# EAGLE design BigEasyDriver_v12 (EAGLE 5.06)
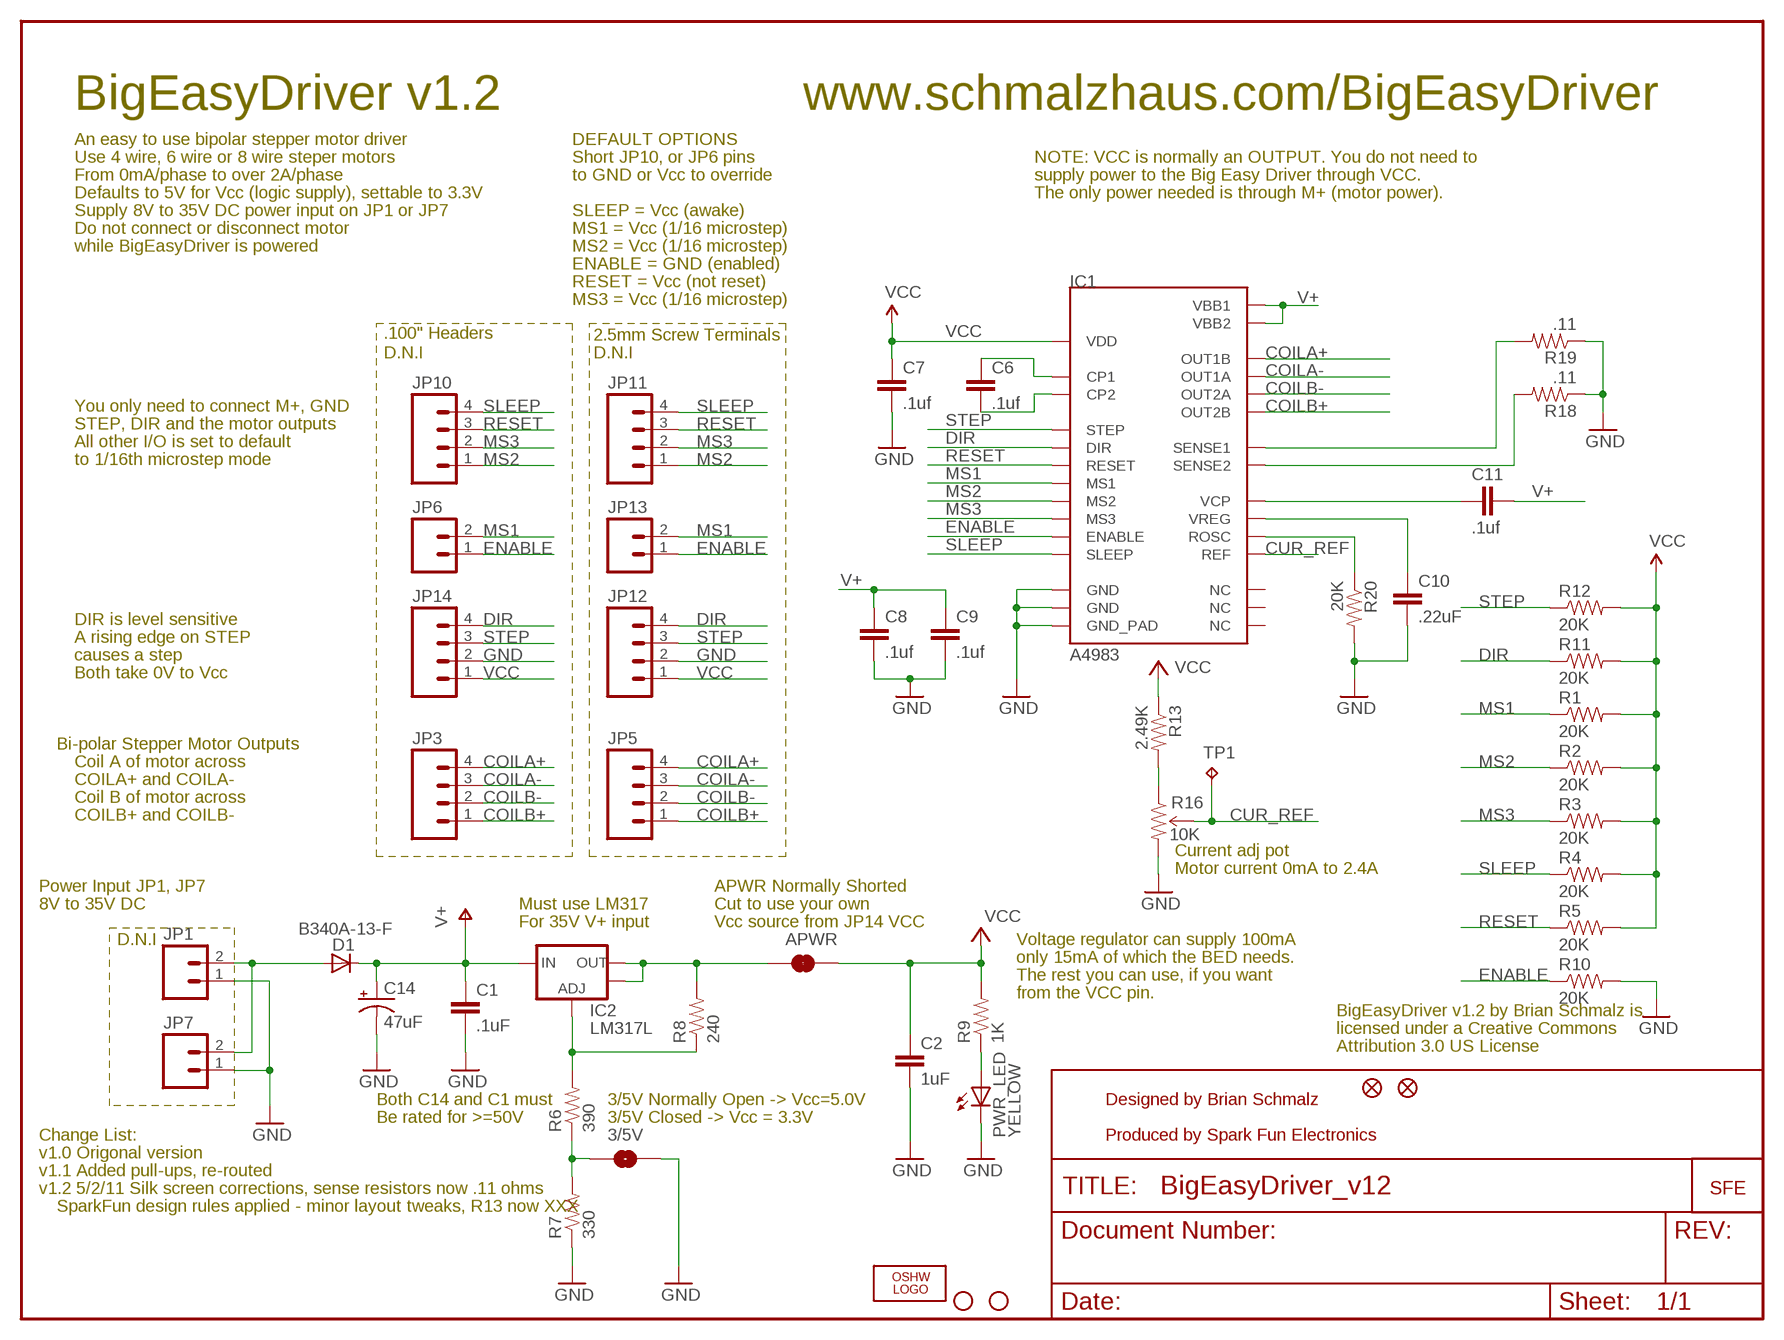
[diagram p0: schematic, sheet 1]

## Parts
3/5V  SOLDERJUMPERNO  [SJ_2S-NO]
APWR  SOLDERJUMPERTRACE  [SJ_2S-TRACE]
C1  .1uF  CAP0402-CAP  [0402-CAP]
C2  1uF  CAP0402-CAP  [0402-CAP]
C6  .1uf  CAP0402-CAP  [0402-CAP]
C7  .1uf  CAP0402-CAP  [0402-CAP]
C8  .1uf  CAP0402-CAP  [0402-CAP]
C9  .1uf  CAP0402-CAP  [0402-CAP]
C10  .22uF  CAP0402-CAP  [0402-CAP]
C11  .1uf  CAP0402-CAP  [0402-CAP]
C14  47uF  CAP_POLD  [PANASONIC_D]
D1  B340A-13-F  DIODE-DO-214AC  [DO-214AC]
IC1  A4983  [QFN-28-5MM]
IC2  LM317L  SPARKFUN03_30_09_V_REG_317SOT89SOT89  [SCHMALZHAUS_SOT89]
JP1  M02PTH  [1X02]
JP2  FIDUCIAL1X2.5  [FIDUCIAL-1X2.5]
JP3  M04PTH  [1X04]
JP4  FIDUCIAL1X2.5  [FIDUCIAL-1X2.5]
JP5  M04SCREW_LOCK  [SCREWTERMINAL-3.5MM-4_LOCK]
JP6  M02PTH  [1X02]
JP7  M023.5MM_LOCK  [SCREWTERMINAL-3.5MM-2_LOCK]
JP8  STAND-OFF  [STAND-OFF]
JP9  STAND-OFF  [STAND-OFF]
JP10  M04PTH  [1X04]
JP11  M04SCREW_LOCK  [SCREWTERMINAL-3.5MM-4_LOCK]
JP12  M04SCREW_LOCK  [SCREWTERMINAL-3.5MM-4_LOCK]
JP13  M023.5MM_LOCK  [SCREWTERMINAL-3.5MM-2_LOCK]
JP14  M04PTH  [1X04]
LOGO1  OSHW_LOGO_FILLX0100-NT  [OSHW_FILLX100_NOTEXT]
PWR_LED  YELLOW  LED0603  [LED-0603]
R1  20K  RESISTOR0402-RES  [0402-RES]
R2  20K  RESISTOR0402-RES  [0402-RES]
R3  20K  RESISTOR0402-RES  [0402-RES]
R4  20K  RESISTOR0402-RES  [0402-RES]
R5  20K  RESISTOR0402-RES  [0402-RES]
R6  390  RESISTOR0402-RES  [0402-RES]
R7  330  RESISTOR0402-RES  [0402-RES]
R8  240  RESISTOR0402-RES  [0402-RES]
R9  1K  RESISTOR0402-RES  [0402-RES]
R10  20K  RESISTOR0402-RES  [0402-RES]
R11  20K  RESISTOR0402-RES  [0402-RES]
R12  20K  RESISTOR0402-RES  [0402-RES]
R13  2.49K  RESISTOR0402-RES  [0402-RES]
R16  10K  TRIMPOTSMD  [TRIMPOT-3MM]
R18  .11  RESISTOR2010  [R2010]
R19  .11  RESISTOR2010  [R2010]
R20  20K  RESISTOR0402-RES  [0402-RES]
TP1  TPPAD1-13  [P1-13]
U$2  LOGO-SFENEW  [SFE-NEW-WEBLOGO]

## Nets
5V_ALT: APWR.1 IC2.OUT IC2.OUT@1(OUT) R8.2
COILA+: IC1.P$21(OUT1B) JP3.4 JP5.4
COILA-: IC1.P$24(OUT1A) JP3.3 JP5.3
COILB+: IC1.P$1(OUT2B) JP3.1 JP5.1
COILB-: IC1.P$26(OUT2A) JP3.2 JP5.2
CUR_REF: IC1.P$17(REF) R16.2(WIPER) TP1.TP
DIR: IC1.P$19(DIR) JP12.4 JP14.4 R11.1
ENABLE: IC1.P$2(ENABLE) JP6.1 JP13.1 R10.1
GND: 3/5V.2 C1.2 C2.2 C7.2 C8.2 C9.2 C10.2 C14.- IC1.P$3(GND) IC1.P$18(GND) IC1.P$29(GND_PAD) JP1.1 JP7.1 JP12.2 JP14.2 PWR_LED.C R7.1 R10.2 R16.3(CW) R18.1 R19.1 R20.2
MS1: IC1.P$9(MS1) JP6.2 JP13.2 R1.1
MS2: IC1.P$10(MS2) JP10.1 JP11.1 R2.1
MS3: IC1.P$11(MS3) JP10.2 JP11.2 R3.1
N$1: D1.A JP1.2 JP7.2
N$2: PWR_LED.A R9.1
N$3: R13.2 R16.1(CCW)
N$4: 3/5V.1 R6.1 R7.2
N$6: IC2.ADJ R6.2 R8.1
N$8: C6.1 IC1.P$4(CP1)
N$9: C6.2 IC1.P$5(CP2)
N$19: IC1.P$13(ROSC) R20.1
N$20: C10.1 IC1.P$8(VREG)
N$21: C11.1 IC1.P$6(VCP)
N$31: IC1.P$27(SENSE2) R18.2
N$32: IC1.P$23(SENSE1) R19.2
RESET: IC1.P$12(RESET) JP10.3 JP11.3 R5.1
SLEEP: IC1.P$14(SLEEP) JP10.4 JP11.4 R4.1
STEP: IC1.P$16(STEP) JP12.3 JP14.3 R12.1
V+: C1.1 C8.1 C9.1 C11.2 C14.+ D1.C IC1.P$22(VBB1) IC1.P$28(VBB2) IC2.IN
VCC: APWR.2 C2.1 C7.1 IC1.P$15(VDD) JP12.1 JP14.1 R1.2 R2.2 R3.2 R4.2 R5.2 R9.2 R11.2 R12.2 R13.1
Unconnected: IC1.P$7(NC) IC1.P$20(NC) IC1.P$25(NC)

## Notes on the sheet
- BigEasyDriver v1.2 | www.schmalzhaus.com/BigEasyDriver
- An easy to use bipolar stepper motor driver | DEFAULT OPTIONS
- Use 4 wire, 6 wire or 8 wire steper motors | Short JP10, or JP6 pins | NOTE: VCC is normally an OUTPUT. You do not need to
- From 0mA/phase to over 2A/phase | to GND or Vcc to override | supply power to the Big Easy Driver through VCC.
- Defaults to 5V for Vcc (logic supply), settable to 3.3V | The only power needed is through M+ (motor power).
- Supply 8V to 35V DC power input on JP1 or JP7 | SLEEP = Vcc (awake)
- Do not connect or disconnect motor | MS1 = Vcc (1/16 microstep)
- while BigEasyDriver is powered | MS2 = Vcc (1/16 microstep)
- ENABLE = GND (enabled)
- RESET = Vcc (not reset)
- MS3 = Vcc (1/16 microstep)
- .100" Headers | 2.5mm Screw Terminals
- D.N.I | D.N.I
- You only need to connect M+, GND
- STEP, DIR and the motor outputs
- All other I/O is set to default
- to 1/16th microstep mode
- DIR is level sensitive
- A rising edge on STEP
- causes a step
- Both take 0V to Vcc
- Bi-polar Stepper Motor Outputs
- Coil A of motor across
- COILA+ and COILA-
- Coil B of motor across
- COILB+ and COILB-
- Current adj pot
- Motor current 0mA to 2.4A
- Power Input JP1, JP7 | APWR Normally Shorted
- 8V to 35V DC | Must use LM317 | Cut to use your own
- For 35V V+ input | Vcc source from JP14 VCC
- D.N.I | Voltage regulator can supply 100mA
- only 15mA of which the BED needs.
- The rest you can use, if you want
- from the VCC pin.
- BigEasyDriver v1.2 by Brian Schmalz is
- licensed under a Creative Commons
- Attribution 3.0 US License
- Both C14 and C1 must | 3/5V Normally Open -> Vcc=5.0V | Designed by Brian Schmalz
- Be rated for >=50V | 3/5V Closed -> Vcc = 3.3V
- Change List: | Produced by Spark Fun Electronics
- v1.0 Origonal version
- v1.1 Added pull-ups, re-routed
- v1.2 5/2/11 Silk screen corrections, sense resistors now .11 ohms
- SparkFun design rules applied - minor layout tweaks, R13 now XXX

## Library data of the parts
3/5V APWR = SparkFun03_30_09:SOLDERJUMPER: Solder Jumper Standard SMD solder jumper. Used to automate production. Two varients : Normally Open and Normally Closed are the same, but have different paste layers. NC will have a large amount of paste and should jumper during reflow.
C1 C2 C6-C11 = SparkFun:CAP: Capacitor Standard 0603 ceramic capacitor, and 0.1" leaded capacitor.
C14 = SparkFun:CAP_POL: Capacitor Polarized These are standard SMD and PTH capacitors. Normally 10uF, 47uF, and 100uF in electrolytic and tantalum varieties. Always verify the external diameter of the through hole cap, it varies with capacity, voltage, and manufacturer. The EIA devices should be standard.
D1 = diode:DIODE-: DIODE
IC1 = SparkFun:A4983: DMOS Microstepping Driver with Translator
IC2 = BigEasyDriver_v11:SPARKFUN03_30_09_V_REG_317: Voltage Regulator Standard LM317 adjustable voltage regulator. AOI (Adjust Output Input). Google LM317 Calculator' for easy to use app to get the two resistor values needed. 240/720 for 5V output. 240/390 for 3.3V output. Spark Fun Electronics SKU : COM-00527'
JP1 JP6 = SparkFun:M02: Header 2 Standard 2-pin 0.1" header. Use with straight break away headers (SKU : PRT-00116), right angle break away headers (PRT-00553), swiss pins (PRT-00743), machine pins (PRT-00117), and female headers (PRT-00115). Molex polarized connector foot print use with SKU : PRT-08233 with associated crimp pins and housings.
JP2 JP4 = abes:FIDUCIAL: Fiducial Alignment Points Various fiducial points for machine vision alignment.
JP3 JP10 JP14 = SparkFun:M04: Header 4 Standard 4-pin 0.1" header. Use with straight break away headers (SKU : PRT-00116), right angle break away headers (PRT-00553), swiss pins (PRT-00743), machine pins (PRT-00117), and female headers (PRT-00115). Molex polarized connector foot print use with SKU : PRT-08231 with associated crimp pins and housings.
JP5 JP11 JP12 = BigEasyDriver_v11:M04: Header 4 Standard 4-pin 0.1" header. Use with straight break away headers (SKU : PRT-00116), right angle break away headers (PRT-00553), swiss pins (PRT-00743), machine pins (PRT-00117), and female headers (PRT-00115). Molex polarized connector foot print use with SKU : PRT-08231 with associated crimp pins and housings.
JP7 JP13 = BigEasyDriver_v11:M02: Header 2 Standard 2-pin 0.1" header. Use with straight break away headers (SKU : PRT-00116), right angle break away headers (PRT-00553), swiss pins (PRT-00743), machine pins (PRT-00117), and female headers (PRT-00115). Molex polarized connector foot print use with SKU : PRT-08233 with associated crimp pins and housings.
JP8 JP9 = SparkFun-7-28-09:STAND-OFF: Stand Off This is the mechanical footprint for a #4 phillips button head screw. Use the keepout ring to avoid running the screw head into surrounding components. SKU : PRT-00447
LOGO1 = OSHW:OSHW_LOGO_FILL
PWR_LED = SparkFun03_30_09:LED: LEDs Standard schematic elements and footprints for 5mm, 3mm, 1206, and 0603 sized LEDs. 5mm - Spark Fun Electronics SKU : COM-00529 (and others)
R1-R13 R18-R20 = SparkFun:RESISTOR: Resistor Basic schematic elements and footprints for 0603, 1206, and PTH resistors.
R16 = SparkFun:TRIMPOT
TP1 = testpad:TP: Test pad
U$2 = SparkFun:LOGO-SFE: Spark Fun Electronics PCB Logo This is the standard Spark Fun Electronics PCB logo.

## Board
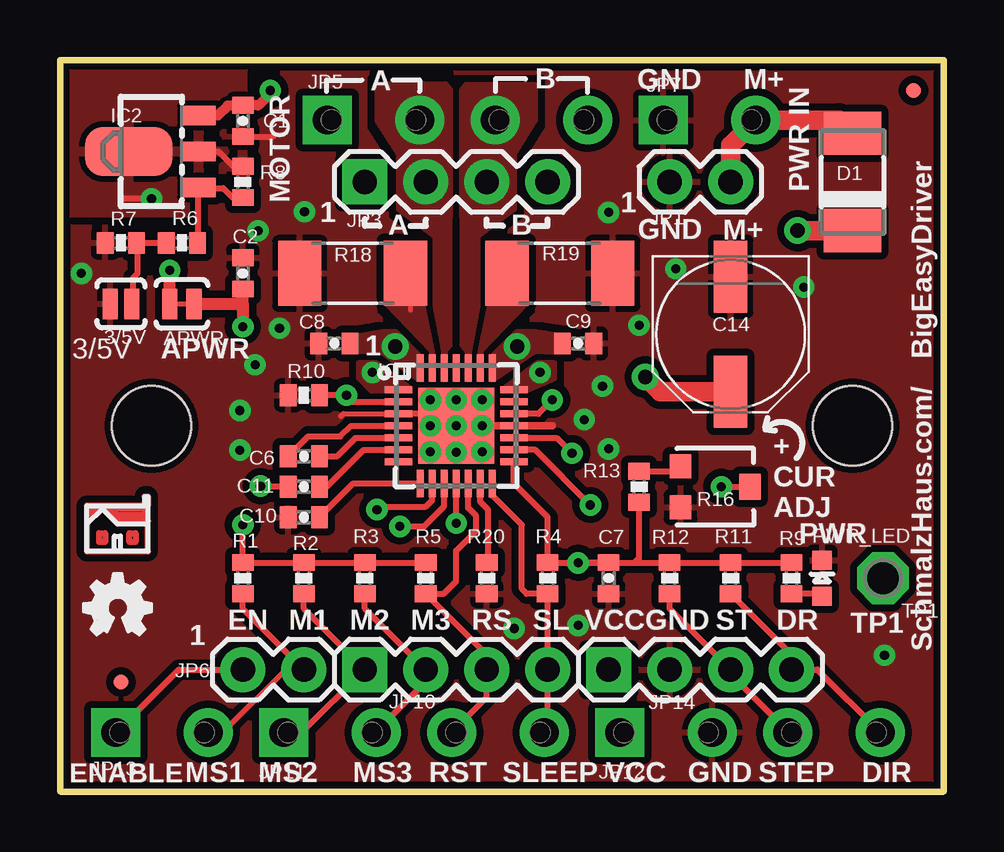
[diagram p1: board, top side]
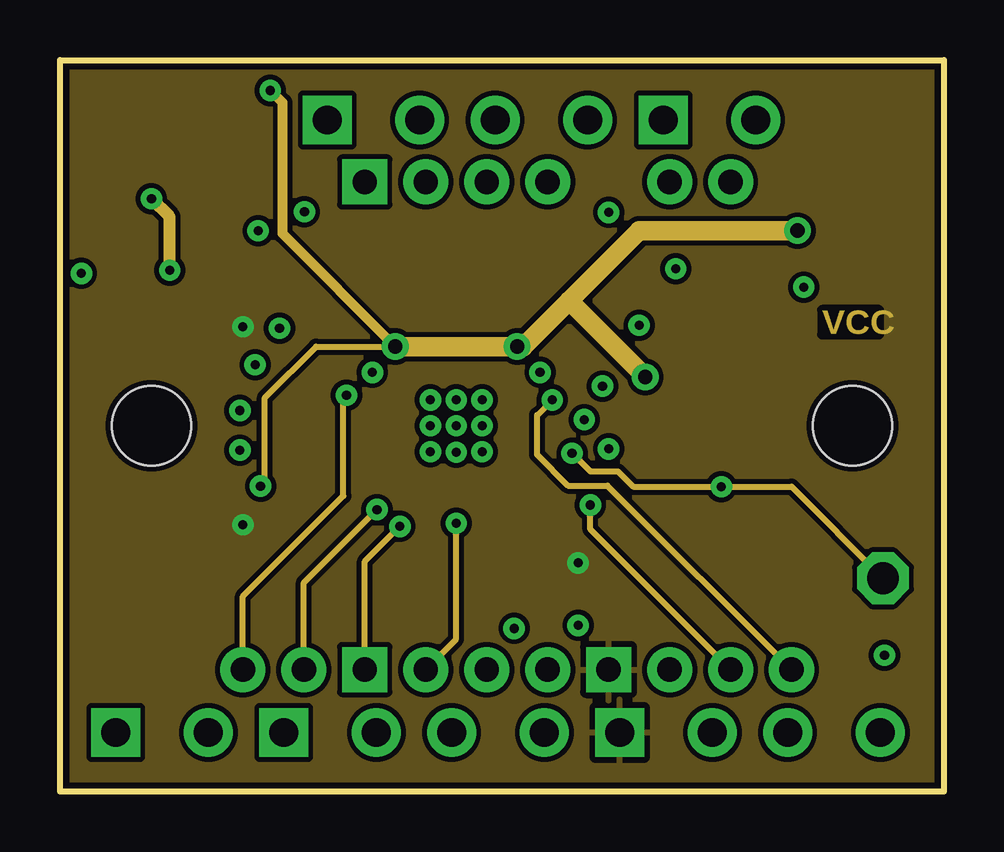
[diagram p2: board, inner layer VCC]
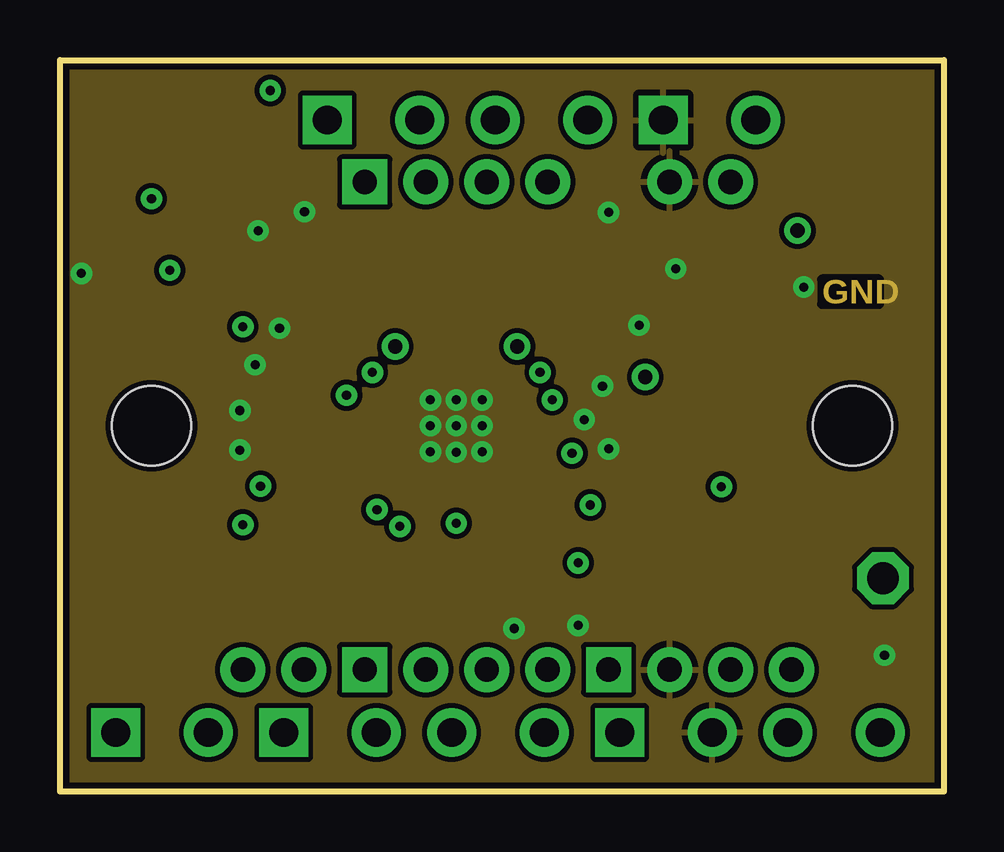
[diagram p3: board, inner layer GND]
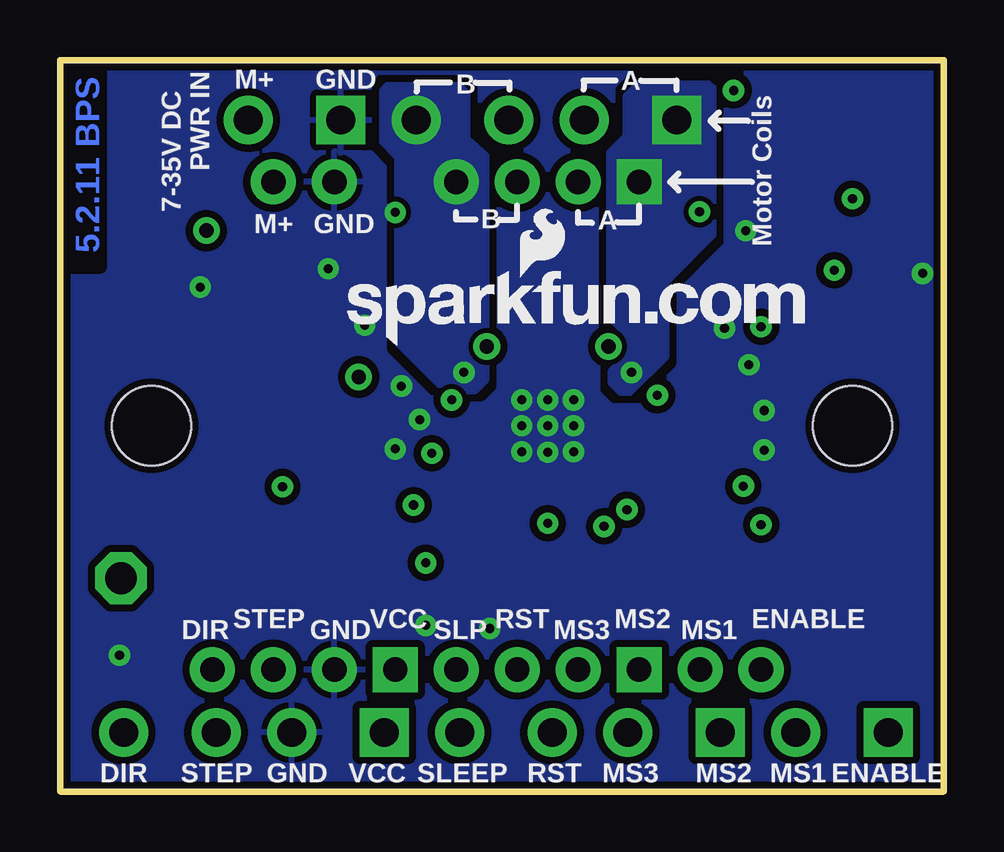
[diagram p4: board, bottom side, seen from below]

Size 36.83 x 30.48 mm. Coordinates in mm from the lower left corner, seen from the top.
Outline: 0,30.48 36.83,30.48 36.83,0 0,0 0,30.48
Copper layers (1*2*15*16): Top 0.035mm / dielectric 1.5mm / VCC 0.035mm / dielectric 0.15mm / GND 0.035mm / dielectric 0.2mm / Bottom 0.035mm
Design rules "GoldPhoenix_8and8_4layer": minimum track width 7mil, minimum drill 15mil, track to track 8mil, track to pad 8mil, pad to pad 8mil, via to via 8mil, smd to smd 8mil, copper to edge 10mil, drill to drill 8mil, minimum pad ring 12mil, minimum via ring 10mil, stop-mask expansion 4mil, vias tented up to drill 25mil, thermal gap 10mil

### Footprints (pad centres in the part's own frame; a part is rotated, then mirrored left to right if it is on the bottom)
SJ_2S-NO = smd 0.635 x 1.27: 1 -0.45,0; 2 0.45,0
SJ_2S-TRACE = smd 0.635 x 1.27: 1 -0.508,0; 2 0.508,0
0402-CAP = smd 0.7 x 0.9: 1 -0.65,0; 2 0.65,0
PANASONIC_D = smd 3 x 1.4: + 2.4,0; - -2.4,0
DO-214AC = smd 1.8 x 2.4: A 2.025,0; C -2.025,0
QFN-28-5MM = smd 1.15 x 0.3: P$1 -2.4,1.5; P$2 -2.4,1; P$3 -2.4,0.5; P$4 -2.4,0; P$5 -2.4,-0.5; P$6 -2.4,-1; P$7 -2.4,-1.5; P$15 2.4,-1.5; P$16 2.4,-1; P$17 2.4,-0.5; P$18 2.4,0; P$19 2.4,0.5; P$20 2.4,1; P$21 2.4,1.5 | smd 0.3 x 1.15: P$8 -1.5,-2.4; P$9 -1,-2.4; P$10 -0.5,-2.4; P$11 0,-2.4; P$12 0.5,-2.4; P$13 1,-2.4; P$14 1.5,-2.4; P$22 1.5,2.4; P$23 1,2.4; P$24 0.5,2.4; P$25 0,2.4; P$26 -0.5,2.4; P$27 -1,2.4; P$28 -1.5,2.4 | smd 3.15 x 3.15: P$29 0,0
SCHMALZHAUS_SOT89 = smd 0.8 x 1.4: ADJ -1.499,-1.981; IN 1.499,-1.981; OUT 0,-1.98 | smd 2.032 x 3.65: OUT@1 0,0.94
1X02 = drill 1.016 pad 1.88 round: 1 0,0; 2 2.54,0
FIDUCIAL-1X2.5 = smd 0.635 x 0.635: 1 0,0
1X04 = drill 1.016 pad 1.88 square: 1 0,0 | drill 1.016 pad 1.88 round: 2 2.54,0; 3 5.08,0; 4 7.62,0
SCREWTERMINAL-3.5MM-4_LOCK = drill 1.2 pad 2.032 square: 1 -0.178,0 | drill 1.2 pad 2.032 round: 2 3.678,0; 3 6.822,0; 4 10.678,0
SCREWTERMINAL-3.5MM-2_LOCK = drill 1.2 pad 2.032 square: 1 -0.178,0 | drill 1.2 pad 2.032 round: 2 3.678,0
STAND-OFF = hole 3.302: 0,0
LED-0603 = smd 0.8 x 0.8: A 0,-0.75; C 0,0.75
0402-RES = smd 0.7 x 0.9: 1 -0.65,0; 2 0.65,0
TRIMPOT-3MM = smd 1 x 0.9: 1 -0.85,-1.45; 3 0.85,-1.45 | smd 1.1 x 0.9: 2 0,1.45
R2010 = smd 1.8 x 2.7: 1 -2.2,0; 2 2.2,0
P1-13 = drill 1.321 pad 2.159 octagon: TP 0,0

### Placement (x,y rotation side)
3/5V  2.54,20.32 180 top
APWR  5.08,20.32 0 top
C1  7.62,27.94 270 top
C2  7.62,21.59 90 top
C6  10.16,13.97 0 top
C7  22.86,8.89 270 top
C8  11.43,18.67 180 top
C9  21.59,18.67 0 top
C10  10.16,11.43 180 top
C11  10.16,12.7 180 top
C14  27.94,19.05 270 top
D1  33.02,25.4 90 top
IC1  16.51,15.24 0 top
IC2  3.81,26.67 90 top
JP1  25.4,25.4 0 top
JP2  35.56,29.21 0 top
JP3  12.7,25.4 0 top
JP4  2.54,4.57 0 top
JP5  11.31,27.98 0 top
JP6  7.62,5.08 0 top
JP7  25.31,27.98 0 top
JP8  3.81,15.24 0 top
JP9  33.02,15.24 0 top
JP10  12.7,5.08 0 top
JP11  9.5,2.46 0 top
JP12  23.5,2.46 0 top
JP13  2.5,2.46 0 top
JP14  22.86,5.08 0 top
LOGO1  0.99,6.53 0 top
PWR_LED  31.75,8.89 0 top
R1  7.62,8.89 90 top
R2  10.16,8.89 90 top
R3  12.7,8.89 90 top
R4  20.32,8.89 90 top
R5  15.24,8.89 90 top
R6  5.08,22.86 0 top
R7  2.54,22.86 0 top
R8  7.62,25.4 90 top
R9  30.48,8.89 90 top
R10  10.16,16.51 180 top
R11  27.94,8.89 90 top
R12  25.4,8.89 90 top
R13  24.13,12.7 90 top
R16  27.3,12.7 270 top
R18  12.19,21.59 0 top
R19  20.83,21.59 180 top
R20  17.78,8.89 270 top
TP1  34.29,8.89 0 top
U$1  [SCHMALZHAUS_SMALL]  2.39,10.01 0 top
U$2  24.87,18.57 0 bottom

### Tracks (layer width: path | path; a pad name or v marks a point on that pad's centre or on a via)
5V_ALT  (via drill 0.38)
  Top 0.254: R8.2 7.22,26.05 6.6,26.67 IC2.OUT | v3.81,24.7 2.6,24.7 2.54,24.77
  Top 0.508: APWR.1 v4.57,21.72
  VCC 0.508: v4.57,21.72 4.57,23.94 v3.81,24.7
  pour Top: 7.62,30.48 0,30.48 0,24.13 7.62,24.13
COILA+  (via drill 0.38)
  other vias: 20,17.46
  pour Bottom (isolate 0.203, no thermals): 19.05,17.78 19.05,17.14 19.56,16.64 20.76,16.64 22.8,18.67 22.8,26.42 23.43,27.05 23.43,29.21 23.18,29.49 20.13,29.46 19.84,29.1 19.84,27.24 19.05,26.53 19.05,17.84 19.11,17.78
  pour Top (isolate 0.203, no thermals): 18.47,16.79 18.47,16.69 19.46,16.71 20.62,17.22 20.62,17.86 19.89,17.86
COILA-
  Top 0.254: IC1.P$24
  pour Top (isolate 0.203, no thermals): 16.94,29.48 19.81,29.48 19.81,27.97 18.92,26.54 18.92,24.26 17.4,23.11 17.4,20.24 17.04,18.34 17.04,18.21 16.97,18.21 16.97,18.34 16.76,18.59 16.74,29.24
COILB+  (via drill 0.38)
  other vias: 13.02,17.46
  pour Top (isolate 0.203, no thermals): 12.42,17.86 12.42,17.25 12.94,16.7 14.57,16.7 14.57,16.83 13.21,17.86
  pour Bottom (isolate 0.203, no thermals): 9.59,29.35 9.59,23.18 11.56,21.21 11.56,18.1 13.08,16.57 13.46,16.57 13.91,17.02 13.91,17.53 13.21,18.22 13.21,18.99 13.97,19.75 13.97,26.63 13.27,27.33 13.27,28.99 12.74,29.53 9.8,29.54
COILB-
  Top 0.254: IC1.P$26
  pour Top (isolate 0.203, no thermals): 16.1,29.46 13.21,29.46 13.21,27.94 14.1,26.54 14.1,24.26 15.62,23.11 15.62,20.27 15.98,18.39 15.98,18.19 16.05,18.19 16.05,18.34 16.26,18.59 16.28,29.24
CUR_REF  (via drill 0.38)
  Top 0.254: IC1.P$17 20.69,14.74 v21.34,14.1 | v27.56,12.7 R16.2
  VCC 0.254: v21.34,14.1 22.1,13.34 23.24,13.34 23.88,12.7 v27.56,12.7 30.48,12.7 TP1.TP
DIR  (via drill 0.38)
  Top 0.254: IC1.P$19 19.93,15.74 v20.51,16.32 | R11.1 30.48,5.7 JP14.4 31.56,5.08 JP12.4
  VCC 0.254: v20.51,16.32 19.88,15.68 19.88,14.03 21.16,12.75 22.81,12.75 JP14.4
ENABLE  (via drill 0.38)
  Top 0.254: IC1.P$2 12.21,16.24 v11.94,16.51 R10.1 | JP13.1 2.32,2.45 4.95,5.08 JP6.1
  VCC 0.254: JP6.1 7.62,8.13 11.81,12.32 11.81,16.38 v11.94,16.51
GND  (via drill 0.38)
  Top 0.203: 15.3,15.75 11.81,15.75 11.68,15.62
  Top 0.254: IC1.P$3 15.3,15.74 15.3,15.75 15.3,15.37 v15.43,15.24 | C1.2 8.88,27.29 8.89,27.3
  Top 0.305: v17.59,15.24 IC1.P$18 20.51,15.24
  other vias: 15.43,16.32 16.51,16.32 17.59,16.32 16.51,15.24 15.43,14.16 16.51,14.14 17.59,14.16 22.61,16.89 30.99,21.02 25.65,21.78 8.26,23.37 0.89,21.59 18.92,6.79 21.59,6.92 34.35,5.68 8.13,17.78 7.49,15.88 24.13,19.43 10.19,24.16 9.14,19.3 7.49,14.22 21.84,15.49 22.86,14.27 22.86,24.13
  pour Top (isolate 0.305, rank 3): 0,30.48 36.83,30.48 36.83,0 0,0
  pour Bottom (isolate 0.305, rank 3): 0,30.48 36.83,30.48 36.83,0 0,0
  pour GND: 0,30.48 36.83,30.48 36.83,0 0,0
MS1  (via drill 0.38)
  Top 0.203: 6.78,2.46 9.4,5.08
  Top 0.254: IC1.P$9 15.51,12.14 15.24,11.87 13.34,11.87 v13.21,11.75 | R1.1 7.62,7.62 JP6.2 9.4,5.08 | JP13.2 6.78,2.46
  VCC 0.254: v13.21,11.75 10.16,8.7 JP6.2
MS2  (via drill 0.38)
  Top 0.254: IC1.P$10 16.01,11.88 15.18,11.05 v14.16,11.05 | JP11.1 10.08,2.46 JP10.1 10.16,7.62 R2.1
  VCC 0.254: v14.16,11.05 12.7,9.59 JP10.1
MS3  (via drill 0.38)
  Top 0.254: JP11.2 13.18,2.51 15.24,4.57 JP10.2 12.7,7.62 R3.1 | v16.51,11.18 IC1.P$11
  VCC 0.254: v16.51,11.18 16.51,6.35 JP10.2
N$1
  Top 0.813: D1.A 32.47,27.98 JP7.2 27.94,26.93 JP1.2
N$2
  Top 0.254: R9.1 31.65,8.24 PWR_LED.A
N$3
  Top 0.254: R13.2 25.66,13.35 R16.1
N$4
  Top 0.254: 3/5V.1 3.05,20.32 3.05,21.4 3.24,21.59 3.24,22.81 R7.2 R6.1
N$6
  Top 0.254: R8.1 7.19,24.75 6.79,25.15 5.82,25.15 IC2.ADJ 5.73,25.11 R6.2
N$8
  Top 0.254: IC1.P$4 12.13,15.24 11.68,14.8 10.34,14.8 C6.1
N$9
  Top 0.254: IC1.P$5 12.33,14.74 11.56,13.97 C6.2
N$19
  Top 0.254: IC1.P$13 17.51,12.08 17.84,11.75 17.84,9.78 | 17.84,9.78 17.8,9.74 | 17.84,9.78 17.84,9.6 R20.1
N$20
  Top 0.254: IC1.P$8 12.22,12.84 C10.1
N$21
  Top 0.254: IC1.P$6 12.65,14.24 11.11,12.7 C11.1
N$31
  Top 0.203: 14.61,20.07 14.61,21.3
  Top 0.254: R18.2 13.97,21.59
  pour Top (isolate 0.203, no thermals): 13.59,20.32 15.48,18.34 15.48,18.17 15.54,18.2 15.11,20.32
N$32
  pour Top (isolate 0.203, no thermals): 17.48,18.21 17.55,18.21 17.55,18.36 19.43,20.32 17.91,20.32
RESET
  Top 0.254: JP11.3 16.32,2.48 17.78,3.94 JP10.3 17.78,5.7 R5.1 15.99,8.24 16.51,8.76 16.51,10.03 17.34,10.86 17.34,11.49 17.01,11.82 IC1.P$12
SLEEP
  Top 0.254: IC1.P$14 18.01,12.34 19.24,11.11 19.24,8.45 19.45,8.24 R4.1 JP10.4 20.32,2.6 JP11.4
STEP  (via drill 0.38)
  Top 0.254: JP12.3 30.32,2.51 27.94,4.89 JP14.3 25.4,7.62 R12.1 | IC1.P$16 19.8,14.24 v22.1,11.94
  VCC 0.254: JP14.3 22.1,10.92 v22.1,11.94
V+  (via drill 0.38, 0.6)
  Top 0.203: IC1.P$28 15.01,18.01
  Top 0.254: IC1.P$22 18.01,18.01 | C11.2 8.36,12.7 v8.36,12.72
  Top 0.406: IC2.IN 6.58,28.17 6.99,28.57 7.61,28.57 C1.1 8.24,28.59 8.26,28.57 8.76,29.08 v8.76,29.21
  Top 0.813: D1.C v30.74,23.38 v30.73,23.37 | C14.+ 25.01,16.65 v24.38,17.27
  VCC 0.254: v8.36,12.72 8.53,12.9 8.53,16.41 10.67,18.54 v13.97,18.54
  VCC 0.406: v8.76,29.21 9.27,28.7 9.27,23.24 v13.97,18.54
  VCC 0.813: v30.73,23.37 24.13,23.37 21.21,20.45 | 21.21,20.45 19.3,18.54 v19.05,18.54 v13.97,18.54 | 21.21,20.45 v24.38,17.27
  pour Top (isolate 0.203, no thermals): 12.37,18.31 12.37,19 13.46,19.18 13.97,19.18 15.06,18.07 15.06,17.18 14.9,17.18 13.36,18.31
  pour Top (isolate 0.203, no thermals): 18.03,18.16 19.05,19.18 19.81,19.18 20.6,19.05 20.6,18.29 19.79,18.31 18.11,17.17 17.98,17.17
VCC  (via drill 0.38)
  Top 0.254: v7.62,11.11 R1.2 R2.2 R3.2 R5.2 | C7.1 R4.2 20.32,11.43 18.91,12.84 IC1.P$15 | R13.1 24.13,9.74 23.93,9.54 | C7.1 23.93,9.54 | 23.93,9.54 R12.2 R11.2 R9.2 | C7.1 22.84,9.53 v21.59,9.53
  Top 0.508: 7.62,20.32 v7.62,19.37 | 7.62,20.32 C2.1 | APWR.2 7.62,20.32
  pour VCC: 0,30.48 36.83,30.48 36.83,0 0,0

### Text on the board
VCC: VCC
GND: GND
Bottom: 5.2.11 BPS
tPlace: A | B | GND | M+ | MOTOR | PWR IN | 1 | 1 | A | B | GND | M+ | 3/5V | APWR | 1 | BigEasyDriver | + | CUR | ADJ | PWR | EN | M1 | M2 | M3 | RS | SL | VCC | GND | ST | DR | TP1 | 1 | SchmalzHaus.com/ | ENABLE | MS1 | MS2 | MS3 | RST | SLEEP | VCC | GND | STEP | DIR
bPlace: A | B | GND | M+ | PWR IN | 7-35V DC | Motor Coils | A | B | GND | M+ | ENABLE | MS2 | RST | VCC | STEP | MS1 | MS3 | SLP | GND | DIR | ENABLE | MS1 | MS2 | MS3 | RST | SLEEP | VCC | GND | STEP | DIR